# EAGLE design LightControl5C (EAGLE 7.7.0)
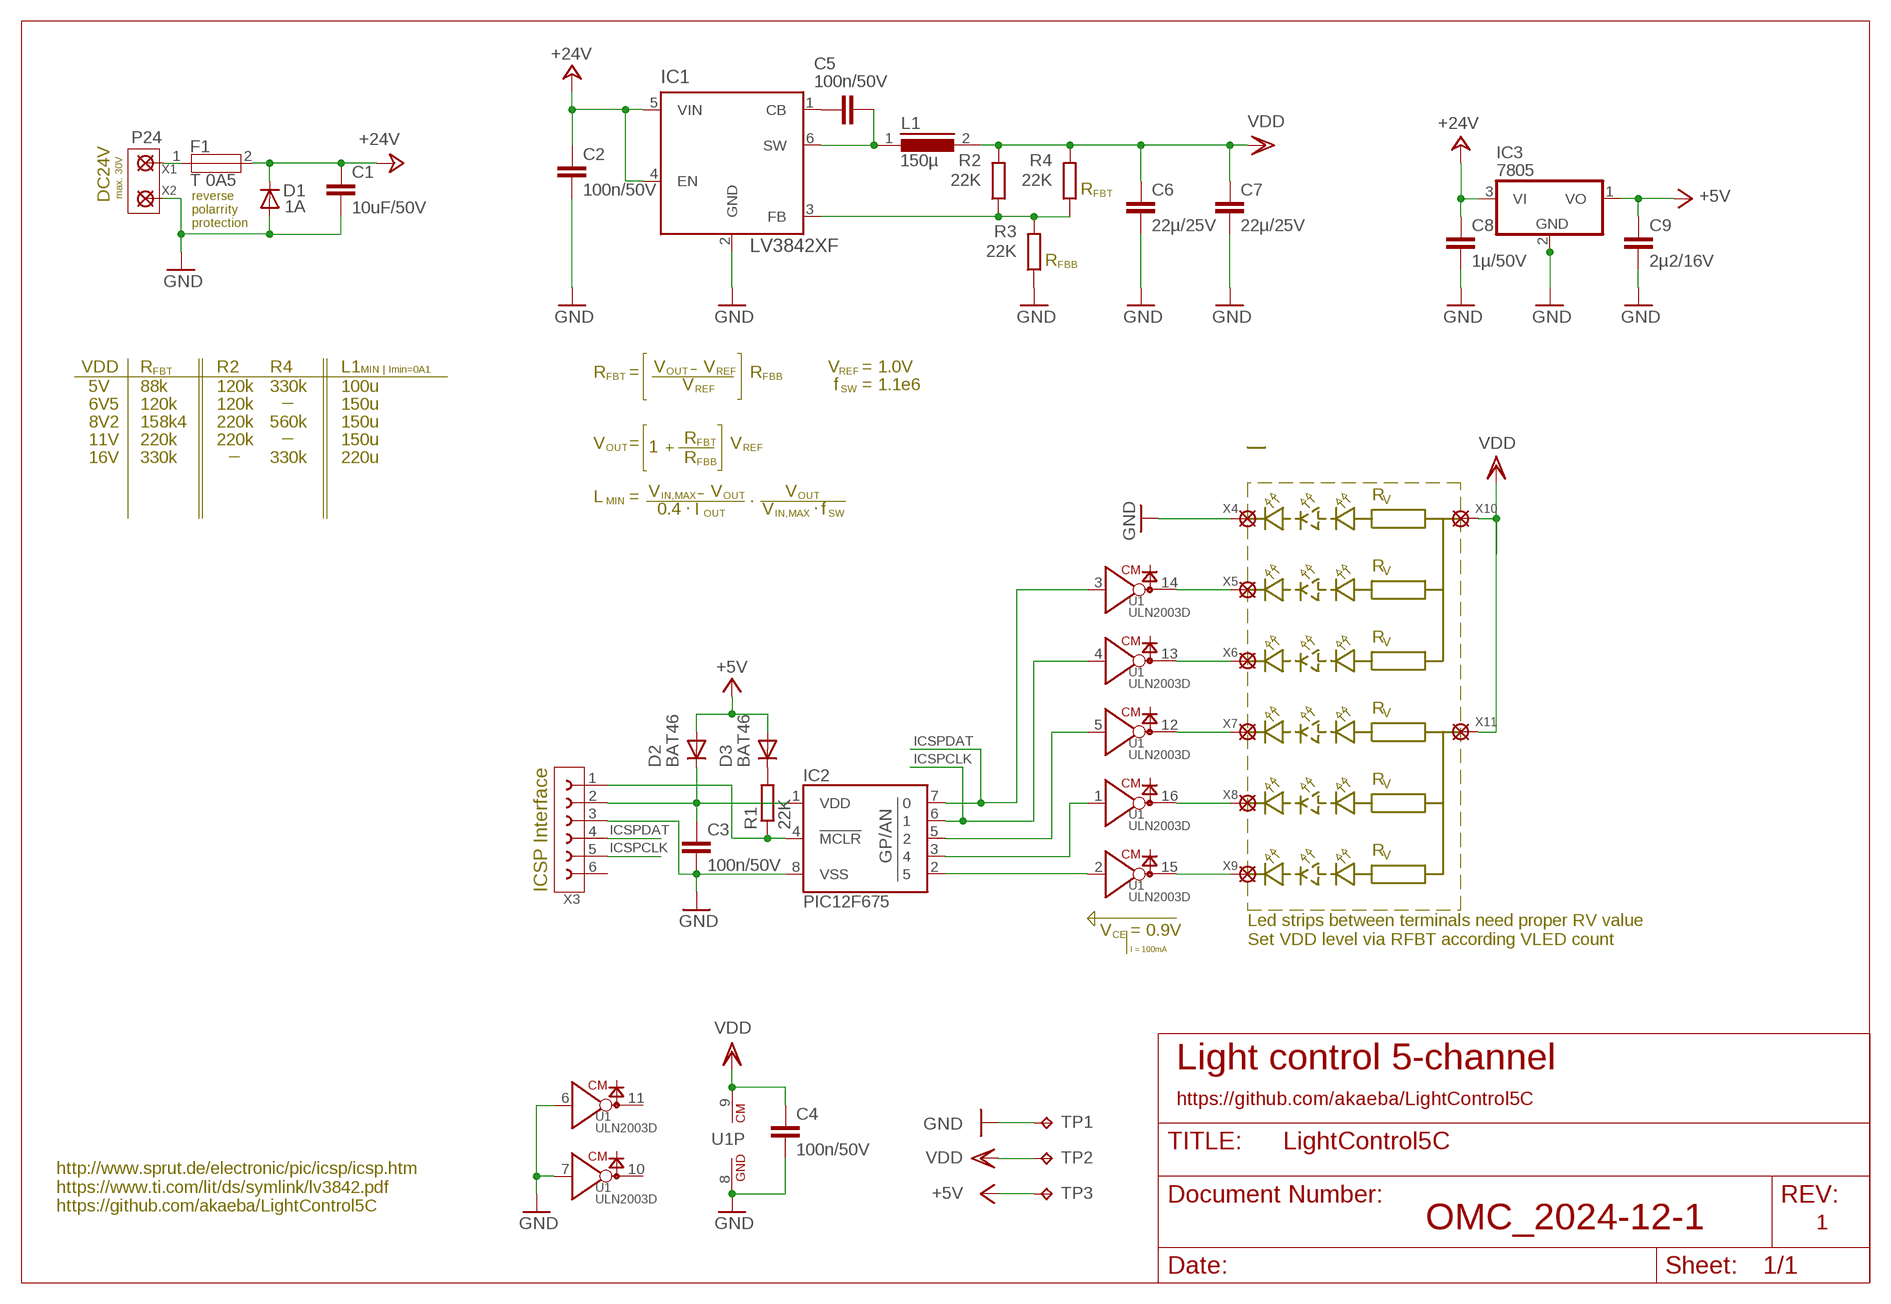
[diagram p0: schematic, sheet 1]

## Parts
C1  10uF/50V  C-EUC2220K  [C2220K]
C2  100n/50V  X7R-100000P-0805  [0805]
C3  100n/50V  X7R-100000P-0805  [0805]
C4  100n/50V  X7R-100000P-0805  [0805]
C5  100n/50V  X7R-100000P-0805  [0805]
C6  22µ/25V  X5R-22000000P-1210  [1210]
C7  22µ/25V  X5R-22000000P-1210  [1210]
C8  1µ/50V  X7R-1000000P-0805  [0805]
C9  2µ2/16V  X7R-2200000P-0805  [0805]
D1  1A  RS1B  [DO214AC]
D2  BAT46  BAT46W  [SOD123]
D3  BAT46  BAT46W  [SOD123]
F1  T 0A5  OMT-T0A75-125V  [OMT125]
IC1  LV3842XF  LV3842  [SOT23-6]
IC2  PIC12F675  PIC12F675SN  [SOIC08]
IC3  7805  78L05ACY  [SOT89W]
L1  150µ  PISM-150U  [PISM]
R1  22K  RC0805-22000  [0805]
R2  22K  RC0805-22000  [0805]
R3  22K  RC0805-22000  [0805]
R4  22K  RC0805-22000  [0805]
TP1  TPB1,27  [B1,27]
TP2  TPB1,27  [B1,27]
TP3  TPB1,27  [B1,27]
U1  ULN2003D  [SOIC16]
X1  Footprint  1X1S-L38W19  [L38W19X1]
X2  Footprint  1X1S-L38W19  [L38W19X1]
X3  FLE-103-01  BOXHD-06-SMT-1.27  [FLE-103]
X4  Footprint  1X1S-L38W19  [L38W19X1]
X5  Footprint  1X1S-L38W19  [L38W19X1]
X6  Footprint  1X1S-L38W19  [L38W19X1]
X7  Footprint  1X1S-L38W19  [L38W19X1]
X8  Footprint  1X1S-L38W19  [L38W19X1]
X9  Footprint  1X1S-L38W19  [L38W19X1]
X10  Footprint  1X1S-L38W19  [L38W19X1]
X11  Footprint  1X1S-L38W19  [L38W19X1]

## Nets
+5V: C9.1 D2.A D3.A IC3.1(VO) TP3.TP
+24V: C1.1 C2.1 C8.1 D1.C F1.2 IC1.4(EN) IC1.5(VIN) IC3.3(VI)
GND: C1.2 C2.2 C3.2 C4.2 C6.2 C7.2 C8.2 C9.2 D1.A IC1.2(GND) IC2.8(VSS) IC3.2(GND) IC3.4(GND) R3.1 TP1.TP U1.6(IN) U1.7(IN) U1.8(P:GND) X2.1 X3.3 X4.1
ICSPCLK: IC2.6 U1.4(IN) X3.5
ICSPDAT: IC2.7 U1.3(IN) X3.4
N$1: IC1.3(FB) R2.1 R3.2 R4.1
N$2: D3.C R1.2
N$3: C3.1 D2.C IC2.1(VDD) X3.2
N$4: IC2.4(!MCLR!) R1.1 X3.1
N$6: C5.1 IC1.1(CB)
N$8: U1.15(OUT) X9.1
N$9: U1.14(OUT) X5.1
N$14: IC2.5 U1.5(IN)
N$15: IC2.3 U1.1(IN)
N$18: IC2.2 U1.2(IN)
N$19: U1.13(OUT) X6.1
N$23: U1.12(OUT) X7.1
N$29: U1.16(OUT) X8.1
N$SWT: C5.2 IC1.6(SW) L1.1
P24: F1.1 X1.1
VDD: C4.1 C6.1 C7.1 L1.2 R2.2 R4.2 TP2.TP U1.9(P:CM+) X10.1 X11.1
Unconnected: U1.10(OUT) U1.11(OUT) X3.6

## Notes on the sheet
- R | FBT
- max. 30V
- DC24V
- reverse
  polarrity
  protection
- R | FBB
- VDD | R | FBT | R2 | R4 | L1 | MIN | Imin=0A1 | V | OUT | V | REF | V | REF | = | 1.0V
- R | FBT | = | R | FBB
- 5V | 88k | 120k | 330k | 100u | V | REF | f | SW | = | 1.1e6
- 6V5 | 120k | 120k | 150u
- 8V2 | 158k4 | 220k | 560k | 150u
- 11V | 220k | 220k | 150u | R | FBT
- V | OUT | = | 1 | V | REF
- 16V | 330k | 330k | 220u | R | FBB
- V | IN,MAX | V | OUT | V | OUT | R
- L | MIN | = | . | V
- . | .
- 0.4 | I | OUT | V | IN,MAX | f | SW
- R | V
- R | V
- R | V
- R
- V
- R
- V
- ICSP Interface
- V | CE | = | 0.9V
- Led strips between terminals need proper RV value
  Set VDD level via RFBT according VLED count
- I = 100mA
- Light control 5-channel
- https://github.com/akaeba/LightControl5C
- http://www.sprut.de/electronic/pic/icsp/icsp.htm
  https://www.ti.com/lit/ds/symlink/lv3842.pdf
  https://github.com/akaeba/LightControl5C
- OMC_2024-12-1 | 1

## Library data of the parts
C1 = rcl:C-EU: CAPACITOR, European symbol
C2-C5 = omcCapacitor:X7R: X7R Ceramic Capacitors YAGEO Multilayer Capacitors For General Purpose Temperature characteristics: X7R Rated Voltage: 50V Operating Temperature Range: –55°C to +125°C Reichelt Datasheet <http://cdn-reichelt.de/documents/datenblatt/B300/X7R.pdf> MURATA GCM Series High Dielectric Constant Type Murata Datasheet <http://www.murata.com/~/media/webrenewal/support/library/catalog/products/capacitor/mlcc/c03e.ashx> Reichelt Datasheet <http://cdn-reichelt.de/documents/datenblatt/A900/DATASHEET_SMD_0805_1206_1210.pdf>; DIST#REICHELT#: X7R-G0805 100N; VENDOR#: YAGEO,08052R104K9BB0D
C6 C7 = omcCapacitor:X5R: X5R Ceramic Capacitors Murate GRM Series For General Purpose Temperature characteristics: X5R Size: 0.4×0.2mm to 5.7×5.0mm Rated Voltage: DC2.5V to 3.15kV Operating Temperature Range: –55°C to +85°C Product Side <http://psearch.en.murata.com/capacitor/lineup/grm> Murata Datasheet <http://www.murata.com/~/media/webrenewal/support/library/catalog/products/capacitor/mlcc/c02e.ashx> Distributor Reichelt: avialable Conrad: avialable Digi-Key: -; DIST#REICHELT#: X5R-G1210 22; VENDOR#: MURATA,GRM32ER61E226ME15#
C8 = omcCapacitor:X7R: X7R Ceramic Capacitors YAGEO Multilayer Capacitors For General Purpose Temperature characteristics: X7R Rated Voltage: 50V Operating Temperature Range: –55°C to +125°C Reichelt Datasheet <http://cdn-reichelt.de/documents/datenblatt/B300/X7R.pdf> MURATA GCM Series High Dielectric Constant Type Murata Datasheet <http://www.murata.com/~/media/webrenewal/support/library/catalog/products/capacitor/mlcc/c03e.ashx> Reichelt Datasheet <http://cdn-reichelt.de/documents/datenblatt/A900/DATASHEET_SMD_0805_1206_1210.pdf>; DIST#REICHELT#: X7R-G0805 1,0/50; VENDOR#: MURATA,GRT21BR71H105KE01
C9 = omcCapacitor:X7R: X7R Ceramic Capacitors YAGEO Multilayer Capacitors For General Purpose Temperature characteristics: X7R Rated Voltage: 50V Operating Temperature Range: –55°C to +125°C Reichelt Datasheet <http://cdn-reichelt.de/documents/datenblatt/B300/X7R.pdf> MURATA GCM Series High Dielectric Constant Type Murata Datasheet <http://www.murata.com/~/media/webrenewal/support/library/catalog/products/capacitor/mlcc/c03e.ashx> Reichelt Datasheet <http://cdn-reichelt.de/documents/datenblatt/A900/DATASHEET_SMD_0805_1206_1210.pdf>; DIST#REICHELT#: X7R-G0805 2,2/25; VALUE: 2µ2/25V; VENDOR#: MURATA,GRT21BC81E225KA02
D1 = omcDiode:RS1: RS1X - PN Diode For surface mounted application Glass passivated junction chip Built-in strain relief, ideal for automated placement Fast switching for high efficiency Plastic material used carries Underwriters Laboratory Classification 94V-O High temperature soldering: 260°C/10sec at terminals Taiwan Semiconductor Datasheet <http://www.taiwansemi.com/products/datasheet/RS1A%20SERIES_K15.pdf> Reichelt Datasheet <http://cdn-reichelt.de/documents/datenblatt/A400/RS1-TSC.pdf> Maximum Ratings and Electrical Characteristics Type Number Symbol RS1A RS1B RS1D RS1G RS1J RS1K RS1M Unit Maximum Repetitive Peak Reverse Voltage VRRM 50 100 200 400 600 800 100 V Maximum RMS Voltage VRMS 35 70 140 280 420 560 700 V Maximum DC Blocking Voltage VDC 50 100 200 400 600 800 1000 V Maximum Average Forward Rectified Current .375 (9.5mm) Lead Length @ TL=90℃ IF(AV) 1 A Peak Forward Surge Current, 8.3 ms Single Half Sine- waveSuperimposed on Rated Load (JEDEC method) IFSM 30 A Maximum Instantaneous Forward Voltage @ 1A VF 1.3 V Maximum Reverse Current @ Rated VR TA=25 ℃ TA=125 ℃ IR 5 50 µA Maximum Reverse Recovery Time Trr 150 250 500 nS Typical Junction Capacitance Cj 10 pF Typical Thermal Resistance RθjA RθjC 105 32 °C/W Operating Temperature Range TJ -55 to +150 °C Storage Temperature Range TSTG -55 to +150 °C; DIST#REICHET#: RS 1B; VALUE: RS1B; VENDOR#: Taiwan Semiconductor,RS1BHR3G
D2 D3 = omcDiode:BAT46: BAT46 - Schottky Diode metal to silicon diode high breakdown low turn-on voltage Temperature: -65°C...125°C BAT46W 100V/0.15A SOD123 Package Diodes Incorporated Datasheet <http://www.diodes.com/_files/datasheets/ds30044.pdf> Reichelt Datasheet <http://cdn-reichelt.de/documents/datenblatt/A400/BAT46W.pdf> TMMBAT46 30V/0.2A Minimelf Package ST Microelectronics Datasheet <http://www.st.com/web/en/resource/technical/document/datasheet/CD00000815.pdf> Reichelt Datasheet <http://cdn-reichelt.de/documents/datenblatt/A400/BAT46.pdf> BAT46 100V/0.15A DO35 Package Vishay Datasheet <http://www.vishay.com/docs/85662/bat46.pdf> Reichelt Datasheet <http://cdn-reichelt.de/documents/datenblatt/A400/BAT46_VIS.pdf>; DIST#REICHELT#: BAT 46W; VENDOR#: DIODES,BAT46W-7-F
F1 = omcFuse:OMT: OMT - Non resettable SMD Fuse Describtion Directly solderable on printed circuit boards Standards UL 248-14 CSA C22.2 no. 248.14 Approvals UL File Number: E41599 Technical Data Type OMT125 OMT250 Rated Voltage 125 VAC/DC 125 - 250VAC, 125 VDC Rated Current 0.25 - 5 A 0.75 - 5A Breaking Capacity 100 A 50A - 100A Characteristic Time-Lag T Time-Lag T Mounting PCB,SMT Admissible Ambient Air Temp. -40 °C to 85 °C Climatic Category 40/085/21 acc. to IEC 60068-1 Material: Housing Thermoplastic, UL 94V-0 Material: Terminals Tin-Plated Copper Alloy Datasheet Schurter <http://www.schurter.ch/bundles/snceschurter/epim/_ProdPool_/newDS/de/typ_OMT_125.pdf> Reichelt <http://cdn-reichelt.de/documents/datenblatt/C400/typ_OMT_125.pdf> Schurter <http://www.schurter.ch/bundles/snceschurter/epim/_ProdPool_/newDS/de/typ_OMT.pdf> Reichelt <http://cdn-reichelt.de/documents/datenblatt/C400/OMT.pdf> Distributor Reichelt: avialable Conrad: Digi-Key:; DIST#REICHELT#: OMT 125 0,75A; VALUE: T 0A75; VENDOR#: Schurter,3404.0113.11
IC1 = omcPwrSupply:LV3842: TI - LV3842 4-V to 36-V, 600-mA, Synchronous Step-Down Converter 600-mA continuous output currentt Operating input voltage from 4V to 36V Output voltage adjustable from 1V to 34V 98% maximum duty cycle 1.1-MHz switching frequency TI Datasheet <https://www.ti.com/lit/ds/symlink/lv3842.pdf>; VENDOR#: TI,LV3842XFDBVR
IC2 = omcPIC:PIC12F675: PIC12F675 - 8-Pin FLASH-Based 8-Bit CMOS Microcontrollers High Performance RISC CPU: Only 35 instructions All single cycle instructions except branches Operating speed: DC - 20 MHz oscillator/clock input DC - 200 ns instruction cycle Interrupt capability 8-level deep hardware stack Direct, Indirect, and Relative Addressing modes Special Microcontroller Features: Internal and external oscillator options Precision Internal 4 MHz oscillator factory calibrated to ±1% External Oscillator support for crystals and resonators 5 µs wake-up from SLEEP, 3.0V, typical Power saving SLEEP mode Wide operating voltage range - 2.0V to 5.5V Industrial and Extended temperature range Low power Power-on Reset (POR) Power-up Timer (PWRT) and Oscillator Start-up Timer (OST) Brown-out Detect (BOD) Watchdog Timer (WDT) with independent oscillator for reliable operation Multiplexed MCLR/Input-pin Interrupt-on-pin change Individual programmable weak pull-ups Programmable code protection High Endurance FLASH/EEPROM Cell 100,000 write FLASH endurance 1,000,000 write EEPROM endurance FLASH/Data EEPROM Retention: > 40 years Low Power Features: Standby Current: 1 nA @ 2.0V, typical Operating Current: 8.5 µA @ 32 kHz, 2.0V, typical 100 µA @ 1 MHz, 2.0V, typical Watchdog Timer Current: 300 nA @ 2.0V, typical Timer1 oscillator current: 4 µA @ 32 kHz, 2.0V, typical Peripheral Features: 6 I/O pins with individual direction control High current sink/source for direct LED drive Analog comparator module with: One analog comparator Programmable on-chip comparator voltage reference (CVREF) module Programmable input multiplexing from device inputs Comparator output is externally accessible Analog-to-Digital Converter module: 10-bit resolution Programmable 4-channel input Voltage reference input Timer0: 8-bit timer/counter with 8-bit programmable prescaler Enhanced Timer1: 16-bit timer/counter with prescaler External Gate Input mode Option to use OSC1 and OSC2 in LP mode as Timer1 oscillator, if INTOSC mode selected In-Circuit Serial Programming (ICSP) via two pins Reference: Microchip Datasheet <http://ww1.microchip.com/downloads/en/DeviceDoc/41190G.pdf> Reichelt Datasheet <http://cdn-reichelt.de/documents/datenblatt/A300/PIC12F629_PIC12F675%23MIC.pdf> Distributor Reichelt: avl Conrad: Digi-Key:; DIST#REICHELT#: PIC 12F675-I/SN; VENDOR#: Microchip#PIC12F675-I/SN
IC3 = omcPwrSupply:78L: STMicroelectronics - L78L - Positive voltage regulators Output current up to 100 mA Output voltages of 3.3; 5; 6; 8; 9; 10; 12; 15; 18; 24 V Thermal overload protection Short-circuit protection No external components are required STM Datasheet <www.st.com/resource/en/datasheet/l78l.pdf> Reichelt Datasheet <http://cdn-reichelt.de/documents/datenblatt/A200/DS_TS78_SERIES.pdf> (Taiwan Semiconductor); DIST#REICHELT#: TS 78L05 ACY; VENDOR#: STM,L78L05ABUTR
L1 = omcInductor:PISM-: PISM - SMD Power Inductors Inductance: 1µH - 2200µH Current: 0.25A - 10A Mounting: SMD Material: Ferrite Dimension: L: 13mm W: 9.55mm H: 5.35mm Fastron Datasheet <http://www.fastrongroup.com/image-show/56/PISM.pdf?type=Complete-DataSheet&productType=series> Reichelt Datasheet <http://cdn-reichelt.de/documents/datenblatt/B400/PISM.pdf> Inductance L [µH] fL [MHz] SRFmin [MHz] DCRmax [Ω] Rated DC Current [A] Isat IΔT 1.0 0.1 115 0.008 10 6.9 1.5 0.1 90 0.009 9 6.5 2.2 0.1 80 0.010 8 6.2 3.3 0.1 58 0.014 7 5.5 4.7 0.1 49 0.017 6 4.9 6.8 0.1 39 0.022 5.1 4.4 10 0.1 28 0.036 4.2 3.9 15 0.1 22 0.050 3.2 3.2 22 0.1 17 0.060 2.7 2.7 33 0.1 13 0.100 2.1 2.1 47 0.1 10 0.140 1.7 1.7 68 0.1 8.5 0.190 1.5 1.5 100 0.1 7.0 0.280 1.2 1.2 150 0.1 5.3 0.420 1.0 1.0 220 0.1 4.1 0.600 0.85 0.85 330 0.1 3.2 0.900 0.65 0.65 470 0.1 2.8 1.250 0.55 0.55 680 0.1 2.3 2.00 0.45 0.45 1000 0.1 1.7 2.70 0.35 0.35 2200 0.1 1.4 7.00 0.25 0.22 Distributor Reichelt: L-PISM XXµ Conrad: avialable Digi-Key: -; DIST#REICHELT#: L-PISM 150µ; VENDOR#: Fastron,PISM-151X-04
R1-R4 = omcResistor:RC0805: YAGEO RC0805 - General Purpose Chip Resistors Power dissipation: 0.125W 1% Tolerance E96 Series Operating Temperature Range: –55°C to +155°C Maximum Working Voltage: 150V Maximum Overload Voltage: 300V Temperature Coefficient: 10Ω< R≤10MΩ: ±100 ppm/°C R≤10Ω || R>10 MΩ: ±200 ppm/°C Jumper Criteria Rated Current: 2A Maximum Current: 5A Yageo Datasheet <http://www.yageo.ru/pdf/RC0805.pdf> Reichelt Datasheet <http://cdn-reichelt.de/documents/datenblatt/B400/SMD-1206_SMD-0805_SMD-0603%23YAG.pdf> Distributor Reichelt: E12 Conrad: avialable Digi-Key: -; DIST#REICHELT#: SMD-0805 22,0K; VENDOR#: YAGEO,RC0805FR-0722KL
TP1-TP3 = testpad:TP: Test pad; TP_SIGNAL_NAME: GND
U1 = omcTransistor:ULN200: ULN200x - Seven Darlington Arrays seven darlingtons per package output current 500mA per driver (600mA peak) output voltage 50V integrated suppression diodes for inductive loads outputs can be paralleled for higher current TTL/CMOS/PMOS/DTL compatible inputs inputs pinned opposite outputs to simplyfy layout STMicroelectronics Datasheet <http://www.st.com/web/en/resource/technical/document/datasheet/CD00001244.pdf> Reichelt Datasheet <http://cdn-reichelt.de/documents/datenblatt/A200/DS_ULN2003_TOS.pdf> Logic level types Type Logic Level ULN2001 General Purpose, DTL, TTL, PMOS, CMOS ULN2002 14-25V PMOS ULN2003 5V TTL, CMOS ULN2004 6–15V CMOS, PMOS Distributor Reichelt: available Conrad: available Digi-Key:; DIST#REICHELT#: ULN 2003 AD SMD; VENDOR#: STM#ULN2003D1013TR
X1 X2 X4-X11 = omcConnector:1X1S: Single Side X1 Soldering Connector - Footprint only Number of Connections: 1 Technology: SMD THT soldering connection, therefore no parts necessary
X3 = omcConnector:BOXHD-06: Box Header 2X3 Mechanical Terminals: 6 Rows: 2 Operating Temperature: -55°C...+105°C Electrical Imax: 3A RInsulation,min: 1000MΩ Rcontact,max: 20mΩ VAC: 550V

## Board
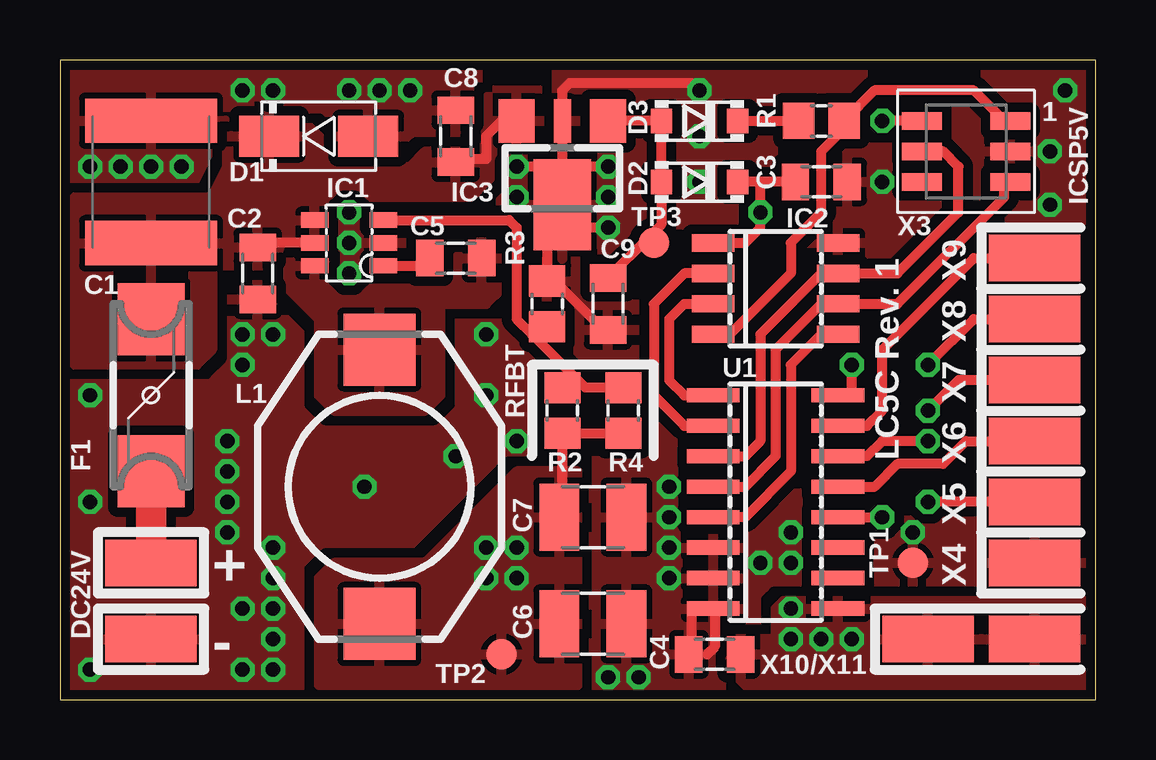
[diagram p1: board, top side]
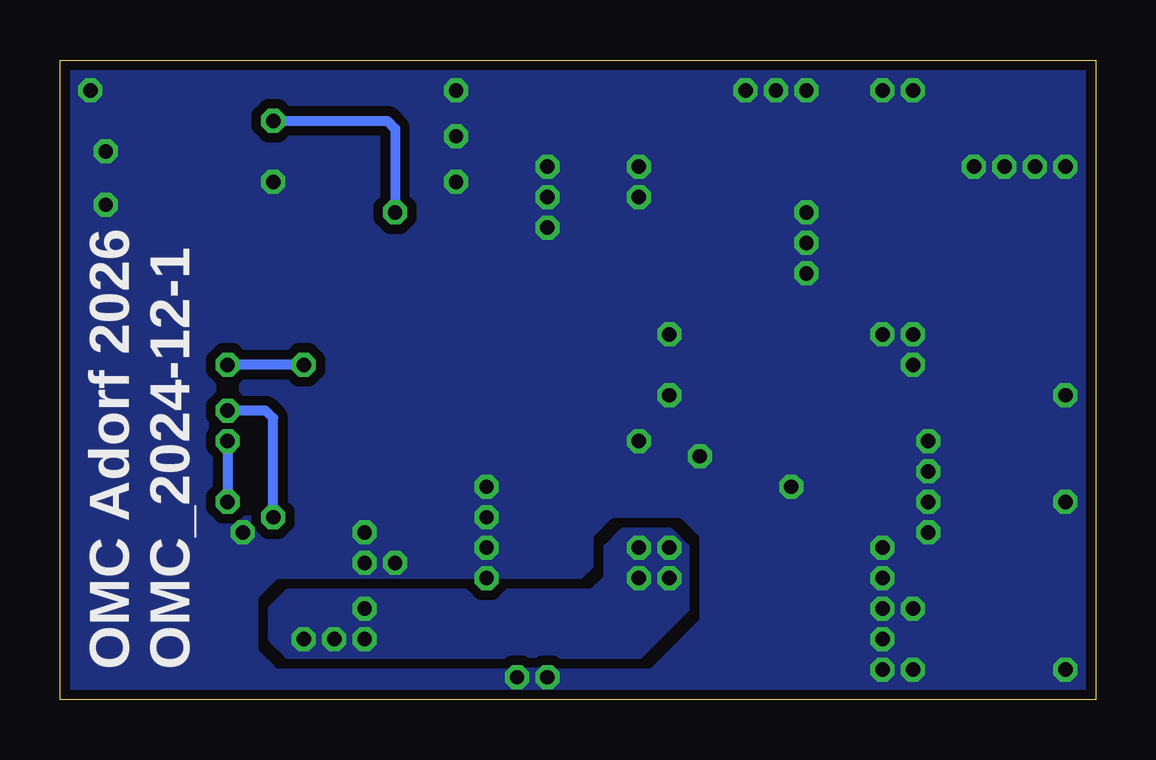
[diagram p2: board, bottom side, seen from below]

Size 43.17 x 26.66 mm. Coordinates in mm from the lower left corner, seen from the top.
Outline: 43.17,26.66 0,26.66 0,0 43.17,0 43.17,26.66
Copper layers (1*16): Top 0.035mm / dielectric 1.5mm / Bottom 0.035mm
Design rules "HakaLp-Zwilling-2_Layer": minimum track width 0.2mm, minimum drill 0.5mm, track to track 0.2mm, track to pad 0.2mm, pad to pad 0.15mm, via to via 0.2mm, smd to smd 0mil, copper to edge 0.2mm, drill to drill 0.2mm, minimum pad ring 0.2mm, minimum via ring 0.2mm, stop-mask expansion 0.1mm, vias tented up to drill 0mil, thermal gap 10mil

### Footprints (pad centres in the part's own frame; a part is rotated, then mirrored left to right if it is on the bottom)
C2220K = smd 1.85 x 5.5: 1 -2.55,0; 2 2.55,0
0805 = smd 1.143 x 1.524: 1 -1.083,0; 2 1.083,0
1210 = smd 1.651 x 2.794: 1 -1.4,0; 2 1.4,0
DO214AC = smd 2.5 x 1.7: A 2.064,0; C -2.064,0
SOD123 = smd 0.889 x 1.016: A 1.587,0; C -1.587,0
OMT125 = smd 3 x 2.8: 1 -3.175,0; 2 3.175,0
SOT23-6 = smd 0.635 x 1.143: 1 -0.953,-1.429; 2 0,-1.429; 3 0.953,-1.429; 4 0.953,1.429; 5 0,1.429; 6 -0.953,1.429
SOIC08 = smd 0.72 x 1.78: 1 -1.905,-2.6; 2 -0.635,-2.6; 3 0.635,-2.6; 4 1.905,-2.6; 5 1.905,2.6; 6 0.635,2.6; 7 -0.635,2.6; 8 -1.905,2.6
SOT89W = smd 1.5 x 1.8: 1 -1.905,-1.905; 3 1.905,-1.905 | smd 0.7 x 1.8: 2 0,-1.905 | smd 2.4 x 3.8: 4 0,1.587
PISM = smd 3 x 3: 1 -5.715,0; 2 5.715,0
0805' = smd 1.3 x 1.5: 1 -0.95,0; 2 0.95,0
B1,27 = smd 1.27 x 1.27: TP 0,0
SOIC16 = smd 0.6 x 2.2: 1 -4.445,-2.6; 2 -3.175,-2.6; 3 -1.905,-2.6; 4 -0.635,-2.6; 5 0.635,-2.6; 6 1.905,-2.6; 7 3.175,-2.6; 8 4.445,-2.6; 9 4.445,2.6; 10 3.175,2.6; 11 1.905,2.6; 12 0.635,2.6; 13 -0.635,2.6; 14 -1.905,2.6; 15 -3.175,2.6; 16 -4.445,2.6
L38W19X1 = smd 3.81 x 1.93: 1 0,0
FLE-103 = smd 0.737 x 1.676: 1 1.27,4.699; 2 1.27,1.016; 3 2.54,4.699; 4 2.54,1.016; 5 3.81,4.699; 6 3.81,1.016

### Placement (x,y rotation side)
C1  3.8,21.58 90 top
C2  8.24,17.77 270 top
C3  31.74,21.58 0 top
C4  27.29,1.9 180 top
C5  16.5,18.4 0 top
C6  22.21,3.17 0 top
C7  22.21,7.61 0 top
C8  16.5,23.48 90 top
C9  22.85,16.5 270 top
D1  10.78,23.48 0 top
D2  26.66,21.58 180 top
D3  26.66,24.12 180 top
F1  3.8,12.69 90 top
IC1  12.05,19.04 90 top
IC2  29.83,17.13 270 top
IC3  20.94,22.21 180 top
L1  13.32,8.88 270 top
R1  22K  [0805']  31.74,24.12 180 top
R2  22K  [0805']  20.94,12.05 270 top
R3  22K  [0805']  20.31,16.5 270 top
R4  22K  [0805']  23.48,12.05 270 top
TP1  35.55,5.71 0 top
TP2  18.4,1.9 0 top
TP3  24.75,19.04 0 top
U1  29.83,8.25 270 top
X1  3.8,5.71 0 top
X2  3.8,2.53 0 top
X3  34.91,25.39 270 top
X4  40.63,5.71 0 top
X5  40.63,8.25 0 top
X6  40.63,10.79 0 top
X7  40.63,13.33 0 top
X8  40.63,15.87 0 top
X9  40.63,18.4 0 top
X10  36.18,2.53 0 top
X11  40.63,2.53 180 top

### Tracks (layer width: path | path; a pad name or v marks a point on that pad's centre or on a via)
+5V
  Top 0.406: 22.85,23.48 IC3.1 | 23.3,24.57 IC3.1 | IC3.1 D3.A D2.A 25.07,19.8 24.53,19.26 | 24.53,19.26 C9.1 | TP3.TP 24.53,19.26
+24V
  Top 0.406: IC3.3 18.4,24.12 17.77,23.48 17.77,22.53 16.63,22.53 C8.1 | 10.78,19.04 8.24,19.04
  pour Top (isolate 0.406): 6.34,14.6 5.7,13.96 0.62,13.96 -0.01,14.6 -0.01,20.31 0.62,20.94 6.34,20.94 6.97,22.21 6.97,24.12 7.61,24.75 9.51,24.75 10.78,23.48 10.78,22.85 11.42,22.21 14.59,22.21 15.23,22.85 17.45,22.85 17.77,23.17 17.77,25.07 18.09,25.39 19.99,25.39 20.31,25.07 20.31,23.17 19.99,22.85 19.04,22.85 17.13,20.94 11.42,20.94 10.78,20.31 10.78,19.04 9.2,19.04 8.88,18.09 6.66,18.09 6.34,17.77
GND  (via drill 0.6)
  Top 0.406: C9.2 22.66,15.42 20.94,17.13 20.62,17.13 R3.1 20.31,19.67 v22.85,19.67 | v22.85,22.21 20.94,22.21 | 20.94,22.21 v19.04,22.21 | 20.94,22.21 IC3.2 20.94,25.39 21.26,25.71 26.34,25.71 v26.66,25.39 | 26.34,1.9 26.34,3.8 | 27.29,3.8 27.29,2.21 26.98,1.9
  other vias: 12.05,20.31 12.05,19.04 12.05,17.77 7.61,25.39 14.59,25.39 8.88,25.39 19.04,20.94 13.32,25.39 12.05,25.39 1.26,22.21 2.53,22.21 3.8,22.21 5.07,22.21 7.61,15.23 8.88,15.23 7.61,13.96 34.28,21.58 6.97,8.25 7.61,3.8 8.88,3.8 8.88,2.53 8.88,5.07 6.97,6.98 7.61,1.26 8.88,1.26 25.39,7.61 25.39,6.34 25.39,5.07 25.39,8.88 1.26,1.26 22.85,20.94 1.26,12.69 41.26,22.85 29.2,5.71 30.47,5.71 35.55,6.98 26.66,21.58 26.66,23.48 22.85,0.94 30.47,6.98 24.12,0.94 41.9,25.39 41.26,20.63 17.77,15.23 19.04,10.79 6.97,10.79 6.97,9.52 8.88,6.34 1.26,8.25 12.69,8.88 16.5,10.15 17.77,12.69
  pour Top (isolate 0.406, rank 2): -0.01,26.66 -0.01,-0.01 43.17,-0.01 43.17,26.66
  pour Bottom (isolate 0.406, rank 2): -0.01,26.66 -0.01,-0.01 43.17,-0.01 43.17,26.66
ICSPCLK
  Top 0.406: U1.4 28.56,8.88 29.83,10.15 29.83,14.6 31.74,16.5 IC2.6 34.91,16.5 39.36,20.94 39.36,21.33 X3.5
ICSPDAT
  Top 0.406: U1.3 28.56,10.15 29.2,10.79 29.2,15.23 31.74,17.77 IC2.7 34.91,17.77 37.45,20.31 37.45,22.21 36.82,22.85 X3.4
N$1
  Top 0.406: IC1.3 18.72,19.99 19.04,19.67 19.04,15.87 19.67,15.23 | 19.67,15.23 19.99,15.23 R3.2 | R4.1 21.9,13.01 21.26,13.64 | 21.26,13.64 19.67,15.23 | R2.1 20.94,13.33 21.26,13.64
N$2
  Top 0.406: D3.C R1.2
N$3  (via drill 0.6)
  Top 0.406: 30.47,21.39 C3.1 29.2,21.58 | IC2.1 28.56,19.04 29.2,19.67 v29.2,20.31 29.2,21.58 | 29.2,21.58 D2.C | X3.2 v34.28,24.12
  Bottom 0.406: v34.28,24.12 29.51,24.12 29.2,23.8 v29.2,20.31
N$4
  Top 0.406: IC2.4 27.93,15.23 30.47,17.77 30.47,19.04 31.74,20.31 31.74,22.85 32.37,23.48 32.37,23.8 R1.1 33.96,25.39 38.09,25.39 39.36,24.12 X3.1
N$6
  Top 0.406: IC1.1 15.1,18.09 C5.1
N$8
  Top 0.406: U1.15 33.64,11.42 34.28,12.05 34.28,14.6 38.09,18.4 X9.1
N$9  (via drill 0.6)
  Top 0.406: X5.1 v36.18,8.25 | v36.18,10.79 34.28,10.79 33.64,10.15 U1.14
  Bottom 0.406: v36.18,10.79 v36.18,8.25
N$14
  Top 0.406: U1.5 28.56,7.61 30.47,9.52 30.47,13.96 31.74,15.23 IC2.5
N$15
  Top 0.406: 27.23,12.75 U1.1 26.02,12.69 25.39,13.33 25.39,15.87 26.02,16.5 IC2.3
N$18
  Top 0.406: IC2.2 26.02,17.77 24.75,16.5 24.75,12.69 26.02,11.42 U1.2
N$19
  Top 0.406: U1.13 33.96,8.88 34.91,9.83 36.82,9.83 37.77,10.79 X6.1
N$23  (via drill 0.6)
  Top 0.406: U1.12 v34.28,7.61 | X7.1 37.45,13.33 v36.18,12.05
  Bottom 0.406: v34.28,7.61 34.28,11.74 34.6,12.05 v36.18,12.05
N$29  (via drill 0.6)
  Top 0.406: v33.01,13.96 33.01,12.69 U1.16 | v36.18,13.96 38.09,15.87 X8.1
  Bottom 0.406: v33.01,13.96 v36.18,13.96
N$SWT
  pour Top (isolate 0.406): 9.51,18.4 9.51,17.13 10.78,15.87 10.78,12.69 11.42,12.05 15.23,12.05 15.86,12.69 15.86,16.5 15.23,17.13 12.05,17.13 11.42,17.77 11.42,18.4
  pour Top (isolate 0.406): 15.86,16.5 17.77,16.5 18.4,17.13 18.4,19.04 17.13,19.04 15.23,17.13
P24
  Top 1.27: X1.1 F1.1
VDD  (via drill 0.6)
  Top 0.406: C7.1 20.94,7.61 R2.2 R4.2
  other vias: 17.77,6.34 19.04,6.34 19.04,5.07 17.77,5.07 30.47,2.53 31.74,2.53 33.01,2.53 30.47,3.8
  pour Top (isolate 0.406): 10.78,0.62 21.58,0.62 21.58,9.52 19.04,9.52 15.23,5.71 11.42,5.71 10.78,5.07
  pour Bottom (isolate 0.406): 17.77,6.98 17.13,6.34 17.13,3.8 19.04,1.9 33.64,1.9 34.28,2.53 34.28,3.8 33.64,4.44 20.94,4.44 20.31,5.07 20.31,6.34 19.67,6.98
  pour Top (isolate 0.406): 29.83,3.8 29.83,2.53 27.93,2.53 27.93,1.26 29.2,-0.01 42.85,-0.01 43.17,0.31 43.17,3.8 42.85,4.12 30.15,4.12

### Text on the board
tPlace: ICSP5V | LC5C Rev. 1 | X9 | X8 | RFBT | X7 | X6 | X5 | + | X4 | DC24V | - | X10/X11
bPlace: OMC Adorf 2026 / OMC_2024-12-1